# EAGLE design dtmf_rx (EAGLE 7.3.0)
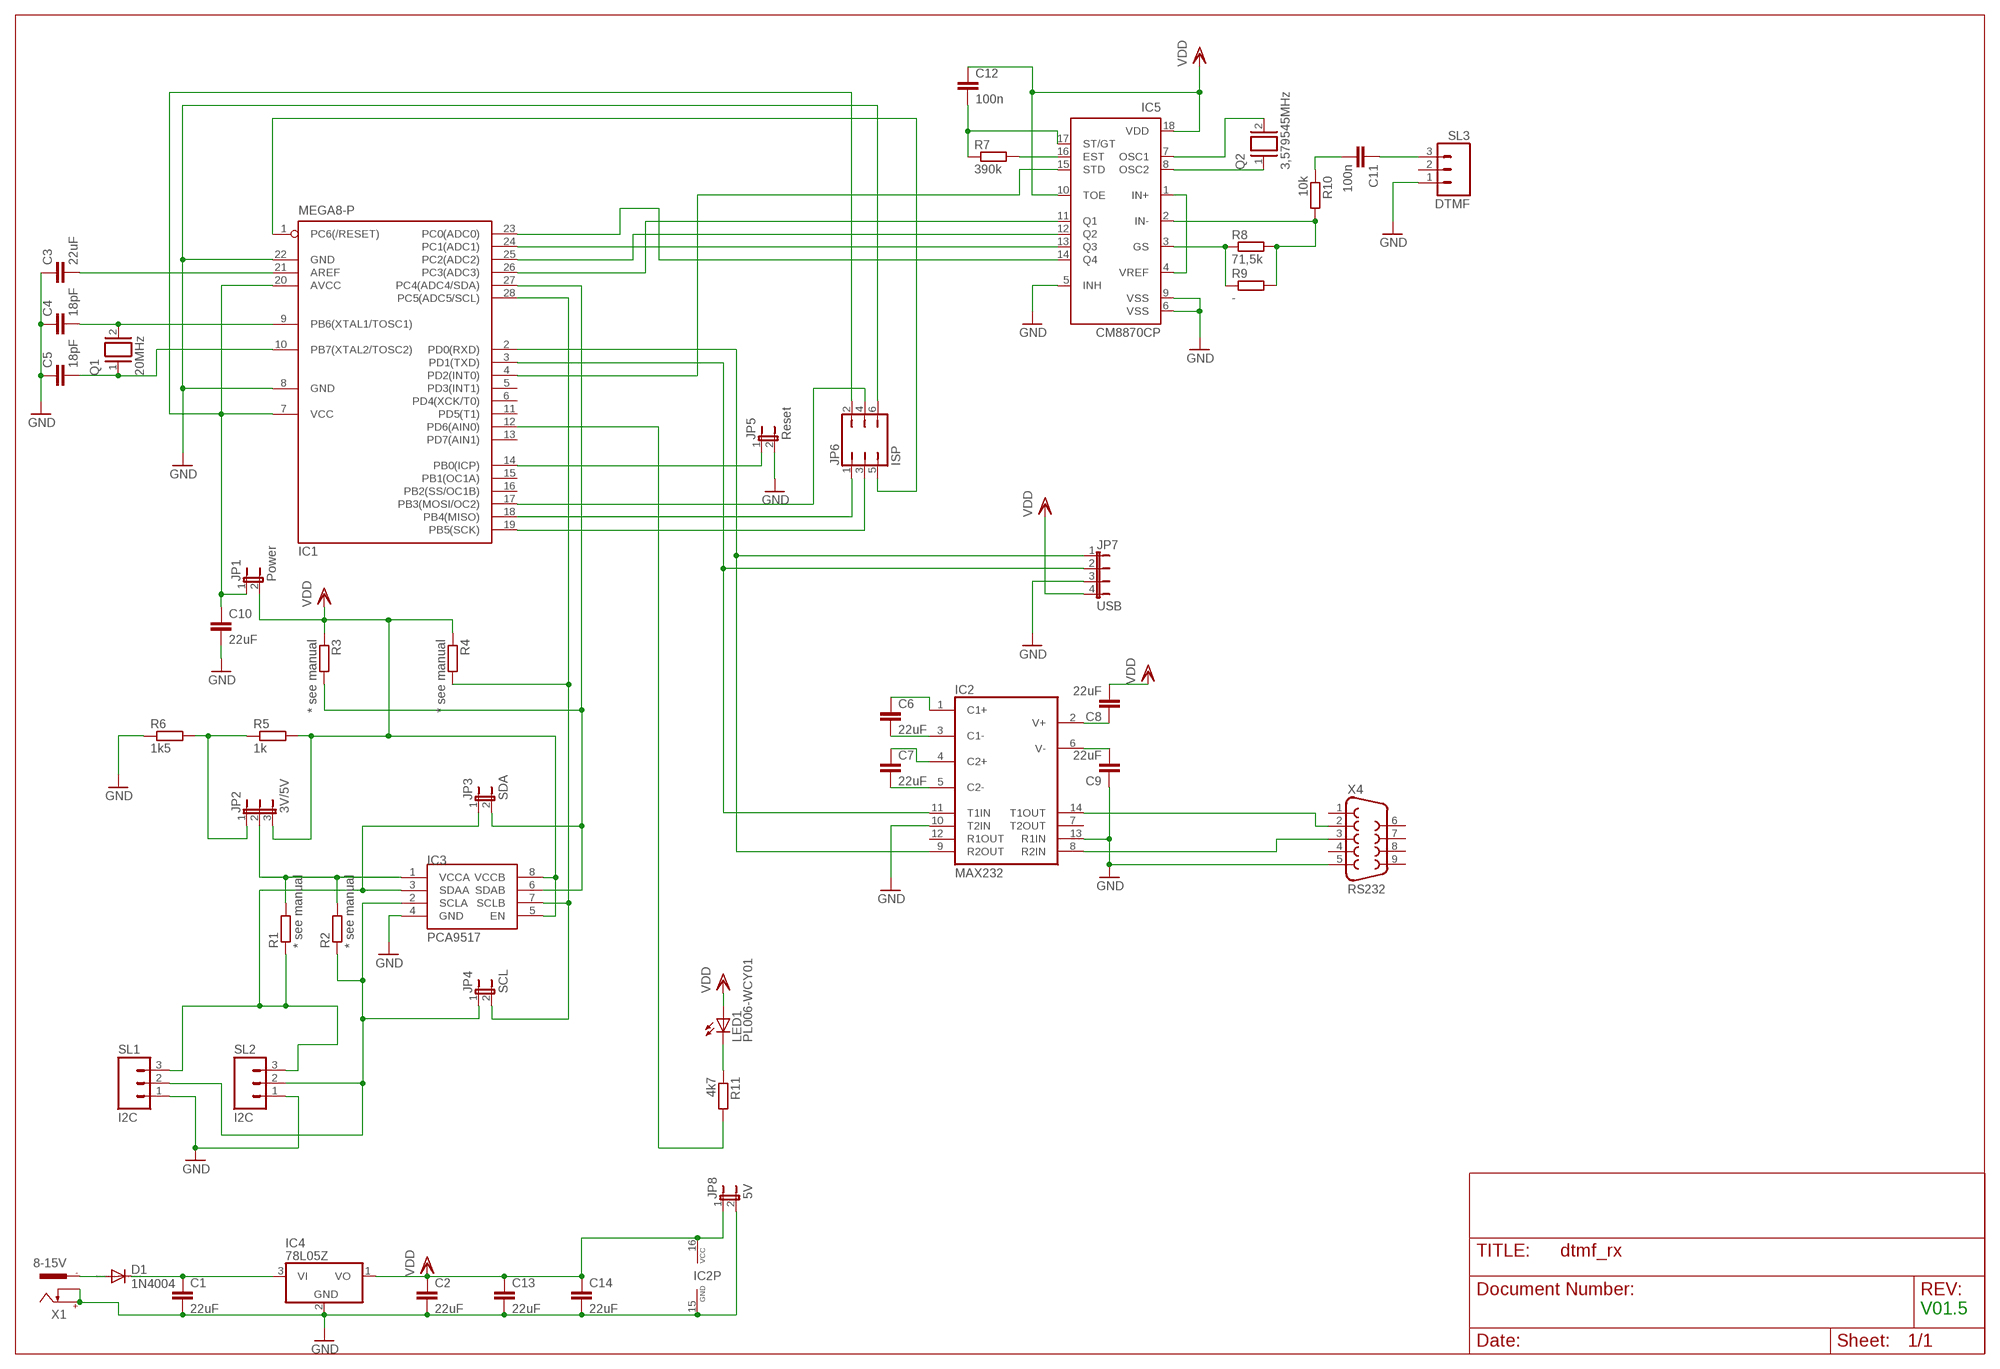
[diagram p0: schematic, sheet 1]

## Parts
C1  22uF  C-EUC1206  [C1206]
C2  22uF  C-EUC1206  [C1206]
C3  22uF  C-EUC1206  [C1206]
C4  18pF  C-EU025-025X050  [C025-025X050]
C5  18pF  C-EU025-025X050  [C025-025X050]
C6  22uF  C-EUC1206  [C1206]
C7  22uF  C-EUC1206  [C1206]
C8  22uF  C-EUC1206  [C1206]
C9  22uF  C-EUC1206  [C1206]
C10  22uF  C-EUC1206  [C1206]
C11  100n  C-EU050-025X075  [C050-025X075]
C12  100n  C-EU050-025X075  [C050-025X075]
C13  22uF  C-EUC1206  [C1206]
C14  22uF  C-EUC1206  [C1206]
D1  1N4004  [DO41-10]
IC1  MEGA8-P  [DIL28-3]
IC2  MAX232  [DIL16]
IC3  PCA9517  [SO-08]
IC4  78L05Z  [TO92]
IC5  CM8870CP  [DIL18]
JP1  Power  JP1E  [JP1]
JP2  3V/5V  JP2E  [JP2]
JP3  SDA  JP1E  [JP1]
JP4  SCL  JP1E  [JP1]
JP5  Reset  JP1E  [JP1]
JP6  ISP  JP3Q  [JP3Q]
JP7  USB  JP4E  [JP4]
JP8  5V  JP1E  [JP1]
LED1  PL006-WCY01  [SOT23]
Q1  20MHz  XTAL/S  [QS]
Q2  3,579545MHz  XTAL/S  [QS]
R1  * see manual  R-EU_R1206  [R1206]
R2  * see manual  R-EU_R1206  [R1206]
R3  * see manual  R-EU_R1206  [R1206]
R4  * see manual  R-EU_R1206  [R1206]
R5  1k  R-EU_R1206  [R1206]
R6  1k5  R-EU_R1206  [R1206]
R7  390k  R-EU_R1206  [R1206]
R8  71,5k  R-EU_R1206  [R1206]
R9  -  R-EU_R1206  [R1206]
R10  10k  R-EU_R1206  [R1206]
R11  4k7  R-EU_R1206  [R1206]
SL1  I2C  M03  [03P]
SL2  I2C  M03  [03P]
SL3  DTMF  M03  [03P]
X1  8-15V  737992-55  [737992-5]
X4  RS232  F09H  [F09H]

## Nets
C13: C6.1 IC2.1(C1+)
GND: C1.2 C2.2 C3.1 C4.1 C5.1 C9.1 C10.2 C13.2 C14.2 IC1.8(GND) IC1.22(GND) IC2.10(T2IN) IC2.13(R1IN) IC2.15(GND) IC3.4(GND) IC4.2(GND) IC5.5(INH) IC5.6(VSS) IC5.9(VSS) JP5.2 JP6.6 JP7.3 JP8.2 R6.1 SL1.1 SL2.1 SL3.1 X1.+ X1.K X4.5
N$1: IC1.12(PD6(AIN0)) R11.2
N$2: IC1.2(PD0(RXD)) IC2.9(R2OUT) JP7.1
N$3: C7.2 IC2.5(C2-)
N$4: IC2.14(T1OUT) X4.2
N$5: IC3.3(SDAA) JP3.1 R1.1 SL1.3 SL2.3
N$6: IC1.14(PB0(ICP)) JP5.1
N$7: IC5.1(IN+) IC5.4(VREF)
N$8: IC1.23(PC0(ADC0)) IC5.14(Q4)
N$10: JP2.1 R5.1 R6.2
N$11: IC2.8(R2IN) X4.3
N$12: IC1.3(PD1(TXD)) IC2.11(T1IN) JP7.2
N$13: C7.1 IC2.4(C2+)
N$14: C6.2 IC2.3(C1-)
N$15: IC1.18(PB4(MISO)) JP6.1
N$16: C8.1 IC2.2(V+)
N$17: C9.2 IC2.6(V-)
N$18: IC1.1(PC6(/RESET)) JP6.5
N$19: C4.2 IC1.9(PB6(XTAL1/TOSC1)) Q1.2
N$20: IC1.19(PB5(SCK)) JP6.3
N$21: C11.1 SL3.3
N$23: IC1.28(PC5(ADC5/SCL)) IC3.7(SCLB) JP4.2 R4.2
N$24: C11.2 R10.1
N$25: IC5.2(IN-) R8.2 R9.2 R10.2
N$26: IC5.3(GS) R8.1 R9.1
N$27: D1.A X1.-1
N$28: IC1.17(PB3(MOSI/OC2)) JP6.4
N$29: IC5.8(OSC2) Q2.1
N$30: IC1.24(PC1(ADC1)) IC5.13(Q3)
N$31: IC5.7(OSC1) Q2.2
N$32: IC5.16(EST) R7.2
N$33: C1.1 D1.C IC4.3(VI)
N$34: IC1.26(PC3(ADC3)) IC5.11(Q1)
N$35: C3.2 IC1.21(AREF)
N$36: IC1.27(PC4(ADC4/SDA)) IC3.6(SDAB) JP3.2 R3.2
N$37: C5.2 IC1.10(PB7(XTAL2/TOSC2)) Q1.1
N$38: IC1.25(PC2(ADC2)) IC5.12(Q2)
N$39: IC3.2(SCLA) JP4.1 R2.1 SL1.2 SL2.2
N$40: C12.2 IC5.17(ST/GT) R7.1
N$42: IC1.4(PD2(INT0)) IC5.15(STD)
N$43: IC3.1(VCCA) JP2.2 R1.2 R2.2
N$44: C10.1 IC1.7(VCC) IC1.20(AVCC) JP1.1 JP6.2
N$50: LED1.3(C) R11.1
VDD: C2.1 C8.2 C12.1 C13.1 C14.1 IC2.16(VCC) IC3.5(EN) IC3.8(VCCB) IC4.1(VO) IC5.10(TOE) IC5.18(VDD) JP1.2 JP2.3 JP7.4 JP8.1 LED1.1(A) R3.1 R4.1 R5.2
Unconnected: IC1.5(PD3(INT1)) IC1.6(PD4(XCK/T0)) IC1.11(PD5(T1)) IC1.13(PD7(AIN1)) IC1.15(PB1(OC1A)) IC1.16(PB2(SS/OC1B)) IC2.7(T2OUT) IC2.12(R1OUT) SL3.2 X1.-2 X4.1 X4.4 X4.6 X4.7 X4.8 X4.9

## Notes on the sheet
- V01.5

## Library data of the parts
C1-C3 C6-C14 = rcl:C-EU: CAPACITOR, European symbol
C4 C5 = resistor:C-EU: CAPACITOR, European symbol
D1 = diode:1N4004: DIODE general purpose rectifier, 1 A
IC1 = atmel:MEGA8-P: MICROCONTROLLER 8 Kbytes FLASH, 1 kbytes SRAM, 512 bytes EEPROM, USART, 4-channel 10 bit ADC, 2-channel 8 bit ADC Pin compatible with Atmega48, ATMega88, ATMega168 Source: avr.lbr; OC_FARNELL: unknown; OC_NEWARK: unknown
IC2 = maxim:MAX232: RS232 TRANSCEIVER; MF: MAXIM; MPN: MAX232ACPE+; OC_FARNELL: 9723773; OC_NEWARK: 68K4544
IC3 = PCA9517:PCA9517: PCA9517
IC4 = linear:78*: Positive VOLTAGE REGULATOR Source: http://cache.national.com/ds/LM/LM78L05.pdf http://www.fairchildsemi.com/ds/LM/LM7805.pdf
IC5 = california-micro-devices:CM8870C: CMOS Integrated DTMF Receiver cm8870.pdf; OC_FARNELL: unknown; OC_NEWARK: unknown
JP1 JP3-JP5 JP8 = jumper:JP1E: JUMPER
JP2 = jumper:JP2E: JUMPER
JP6 = jumper:JP3Q: JUMPER
JP7 = jumper:JP4E: JUMPER
LED1 = led:PL006*: PLH006 Series SMD LED SOT23 PLH006-WCR21 Super Red PLH006-WCR12 High Eff Red PLH006-WCG13 Green PLH006-WCY01 Yellow www.p-tec.net Source: http://www.wittig-electronic.de/PTEC/PL006Series.pdf
Q1 Q2 = special:XTAL/S: CRYSTAL
R1-R11 = resistor:R-EU_: RESISTOR, European symbol
SL1-SL3 = con-amp-quick:M03: AMP QUICK CONNECTOR; OC_FARNELL: unknown; OC_NEWARK: unknown
X1 = con-conrad:737992-55: FEMALE PRINT CONNECTOR DIN 45323 (34V/3A), ROKA, distributor Conrad
X4 = con-subd:F09: SUB-D; OC_FARNELL: unknown; OC_NEWARK: unknown

## Board
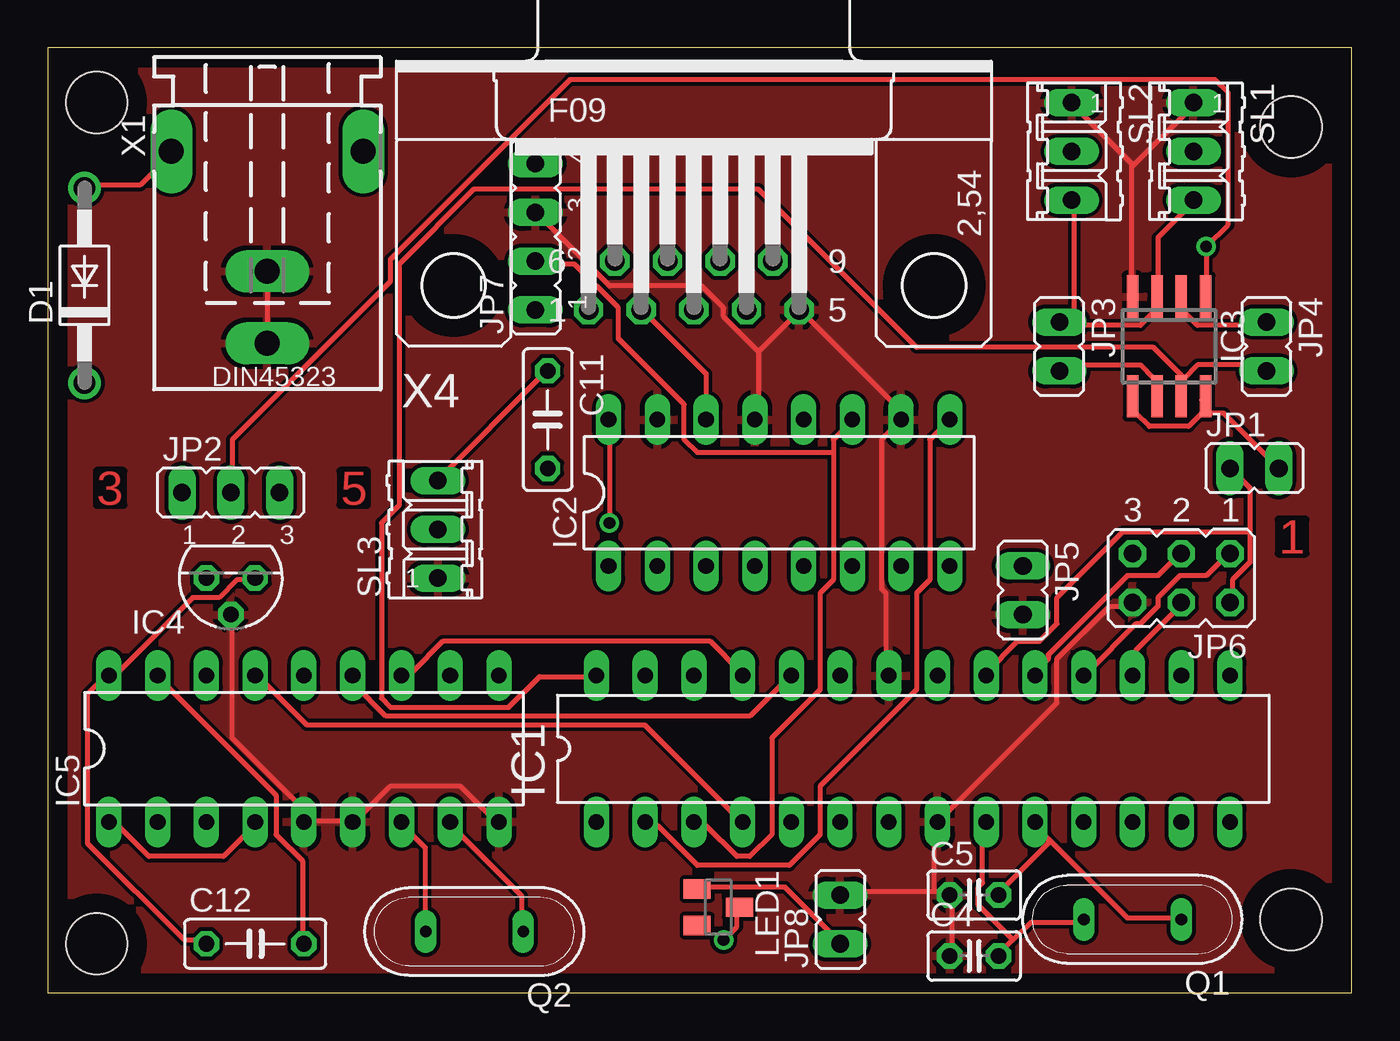
[diagram p1: board, top side]
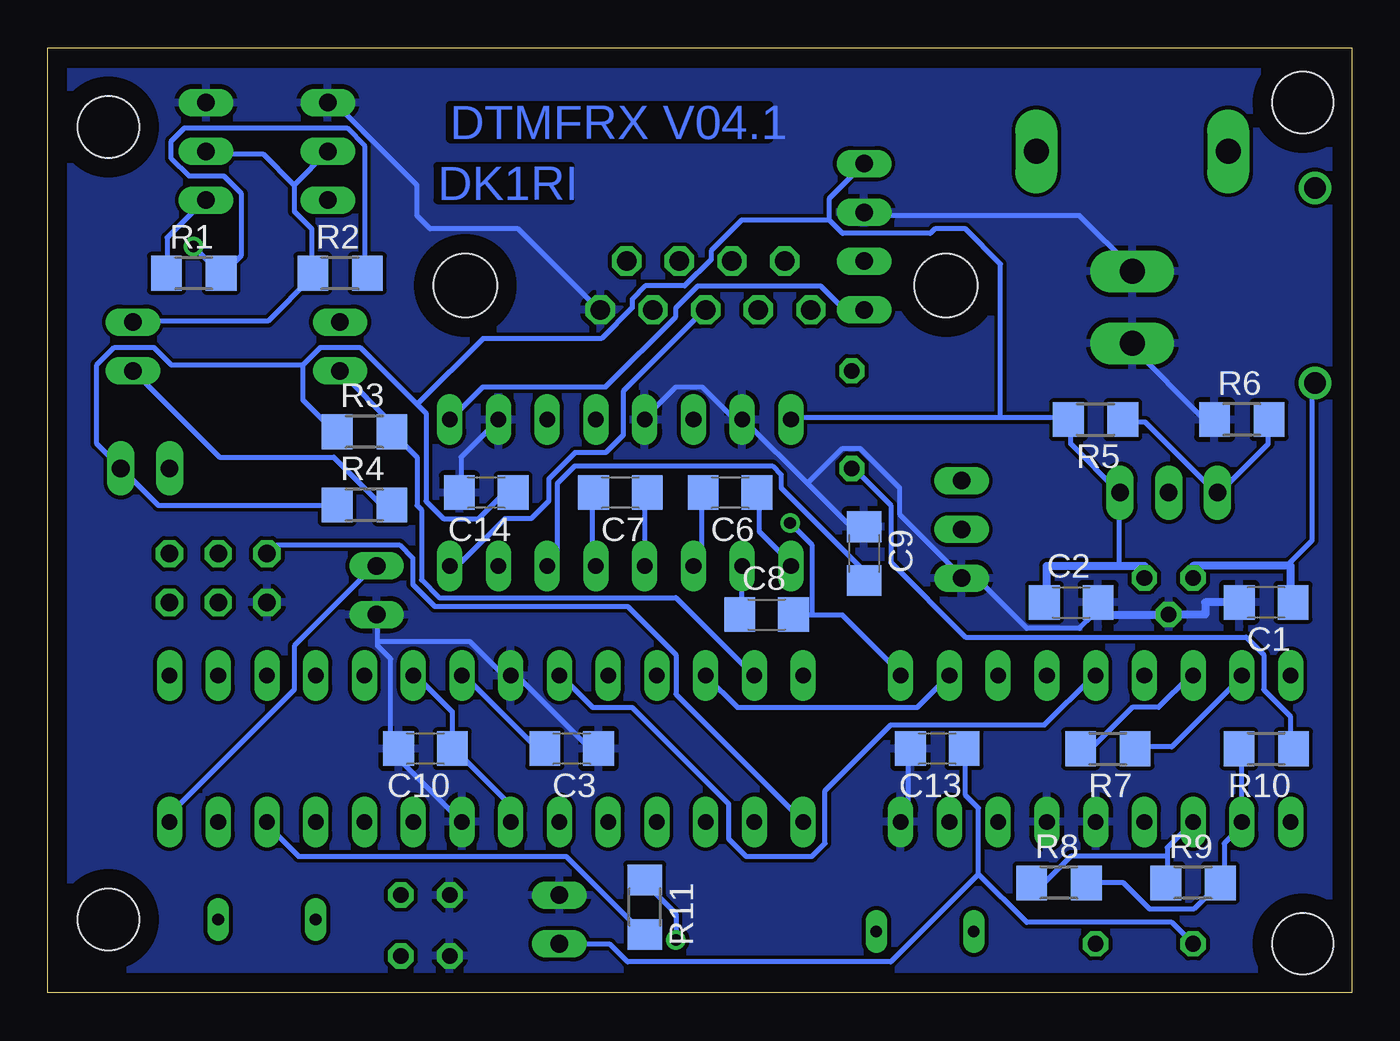
[diagram p2: board, bottom side, seen from below]

Size 67.92 x 49.2 mm. Coordinates in mm from the lower left corner, seen from the top.
Outline: 0,0 67.92,0 67.92,49.2 0,49.2 0,0
Copper layers (1*16): Top 0.035mm / dielectric 1.5mm / Bottom 0.035mm
Design rules "default": minimum track width 10mil, minimum drill 24mil, track to track 8mil, track to pad 8mil, pad to pad 8mil, via to via 8mil, smd to smd 8mil, copper to edge 40mil, drill to drill 8mil, minimum pad ring 10mil, minimum via ring 8mil, stop-mask expansion 4mil, vias tented up to drill 0mil, thermal gap 10mil
Holes 3.2 mm at 2.54,46.35 64.77,45.09 64.77,3.81 2.54,2.54

### Footprints (pad centres in the part's own frame; a part is rotated, then mirrored left to right if it is on the bottom)
C1206 = smd 1.6 x 1.8: 1 -1.4,0; 2 1.4,0
C025-025X050 = drill 0.813 octagon: 1 -1.27,0; 2 1.27,0
C050-025X075 = drill 0.813 octagon: 1 -2.54,0; 2 2.54,0
DO41-10 = drill 1.118: A 5.08,0; C -5.08,0
DIL28-3 = drill 0.813 long: 1 -16.51,-3.81; 2 -13.97,-3.81; 3 -11.43,-3.81; 4 -8.89,-3.81; 5 -6.35,-3.81; 6 -3.81,-3.81; 7 -1.27,-3.81; 8 1.27,-3.81; 9 3.81,-3.81; 10 6.35,-3.81; 11 8.89,-3.81; 12 11.43,-3.81; 13 13.97,-3.81; 14 16.51,-3.81; 15 16.51,3.81; 16 13.97,3.81; 17 11.43,3.81; 18 8.89,3.81; 19 6.35,3.81; 20 3.81,3.81; 21 1.27,3.81; 22 -1.27,3.81; 23 -3.81,3.81; 24 -6.35,3.81; 25 -8.89,3.81; 26 -11.43,3.81; 27 -13.97,3.81; 28 -16.51,3.81
DIL16 = drill 0.813 long: 1 -8.89,-3.81; 2 -6.35,-3.81; 3 -3.81,-3.81; 4 -1.27,-3.81; 5 1.27,-3.81; 6 3.81,-3.81; 7 6.35,-3.81; 8 8.89,-3.81; 9 8.89,3.81; 10 6.35,3.81; 11 3.81,3.81; 12 1.27,3.81; 13 -1.27,3.81; 14 -3.81,3.81; 15 -6.35,3.81; 16 -8.89,3.81
SO-08 = smd 0.6 x 2.2: 1 -1.905,-2.6; 2 -0.635,-2.6; 3 0.635,-2.6; 4 1.905,-2.6; 5 1.905,2.6; 6 0.635,2.6; 7 -0.635,2.6; 8 -1.905,2.6
TO92 = drill 0.813 octagon: 1 -1.27,0; 2 0,1.905; 3 1.27,0
DIL18 = drill 0.813 long: 1 -10.16,-3.81; 2 -7.62,-3.81; 3 -5.08,-3.81; 4 -2.54,-3.81; 5 0,-3.81; 6 2.54,-3.81; 7 5.08,-3.81; 8 7.62,-3.81; 9 10.16,-3.81; 10 10.16,3.81; 11 7.62,3.81; 12 5.08,3.81; 13 2.54,3.81; 14 0,3.81; 15 -2.54,3.81; 16 -5.08,3.81; 17 -7.62,3.81; 18 -10.16,3.81
JP1 = drill 0.914 long: 1 0,-1.27; 2 0,1.27
JP2 = drill 0.914 long: 1 -2.54,0; 2 0,0; 3 2.54,0
JP3Q = drill 0.914 octagon: 1 -2.54,-1.27; 2 -2.54,1.27; 3 0,-1.27; 4 0,1.27; 5 2.54,-1.27; 6 2.54,1.27
JP4 = drill 0.914 long: 1 -3.81,0; 2 -1.27,0; 3 1.27,0; 4 3.81,0
SOT23 = smd 1 x 1.4: 1 -0.95,-1.1; 2 0.95,-1.1; 3 0,1.1
QS = drill 0.61 long: 1 -2.54,0; 2 2.54,0
R1206 = smd 1.6 x 1.803: 1 -1.422,0; 2 1.422,0
03P = drill 0.914 long: 1 -2.54,0; 2 0,0; 3 2.54,0
737992-5 = drill 1.3 pad 2.184 long: + 0,10; -1 5,0; -2 -5,0; K 0,6.25
F09H = drill 1.016 octagon: 1 -5.486,-1.27; 2 -2.743,-1.27; 3 0,-1.27; 4 2.743,-1.27; 5 5.486,-1.27; 6 -4.115,1.27; 7 -1.372,1.27; 8 1.372,1.27; 9 4.115,1.27 | hole 3.302: -12.522,0; 12.522,0

### Placement (x,y rotation side)
C1  4.45,20.32 180 bottom
C2  14.61,20.32 0 bottom
C3  40.64,12.7 180 bottom
C4  48.26,1.91 0 top
C5  48.26,5.08 0 top
C6  32.38,26.04 180 bottom
C7  38.1,26.04 180 bottom
C8  30.48,19.68 0 bottom
C9  25.4,22.86 270 bottom
C10  48.26,12.7 180 bottom
C11  26.04,29.84 270 top
C12  10.79,2.54 0 top
C13  21.59,12.7 180 bottom
C14  45.09,26.04 180 bottom
D1  1.91,36.83 90 top
IC1  45.09,12.7 0 top
IC2  38.1,26.04 0 top
IC3  58.42,33.66 180 top
IC4  9.53,21.59 180 top
IC5  13.34,12.7 0 top
JP1  62.87,27.3 270 top
JP2  9.53,26.04 0 top
JP3  52.7,33.66 180 top
JP4  63.5,33.66 180 top
JP5  50.8,20.95 180 top
JP6  59.05,21.59 180 top
JP7  25.4,39.37 90 top
JP8  41.27,3.81 0 top
LED1  34.92,4.45 270 top
Q1  56.52,3.81 180 top
Q2  22.23,3.17 180 top
R1  60.33,37.47 0 bottom
R2  52.7,37.47 0 bottom
R3  51.44,29.21 0 bottom
R4  51.44,25.4 0 bottom
R5  13.34,29.84 180 bottom
R6  5.71,29.84 0 bottom
R7  12.7,12.7 180 bottom
R8  15.24,5.71 0 bottom
R9  8.26,5.71 0 bottom
R10  4.45,12.7 180 bottom
R11  36.83,4.45 270 bottom
SL1  59.69,43.81 270 top
SL2  53.34,43.81 270 top
SL3  20.32,24.13 90 top
X1  11.43,43.81 180 top
X4  33.66,36.83 0 top

### Tracks (layer width: path | path; a pad name or v marks a point on that pad's centre or on a via)
C13
  Bottom 0.254: C6.1 30.86,25.83 30.86,24 29.26,22.4 IC2.1
GND
  Top 0.254: C4.1 47.09,2.06 47.09,5.03 C5.1 46.86,5.26 46.18,5.26 | 46.18,5.26 41.38,5.26 JP8.2 | JP6.6 56.46,20.12 55.32,20.12 52.58,17.37 52.58,15.09 46.41,8.91 IC1.8 46.18,8.69 46.18,5.26 | X1.K X1.+ | IC5.9 23.32,8.91 21.49,10.74 17.83,10.74 16,8.91 IC5.6 15.77,8.91 13.49,8.91 IC5.5 13.26,8.91 13.26,9.6 9.6,13.26 9.6,19.66 IC4.2 | 56.46,42.98 56.46,43.2 53.49,46.18 SL2.1 | 56.46,42.98 56.46,36.35 IC3.4 | 56.46,42.98 59.66,46.18 SL1.1 | 37.03,33.38 37.03,29.95 IC2.13 | 37.03,33.38 39.09,35.43 X4.5 39.32,35.43 44.35,30.4 44.35,29.95 IC2.10 44.35,29.72 43.43,28.8 43.43,21.03 43.66,20.8 43.66,16.69 IC1.22 | 37.03,33.38 35.2,35.2 35.2,35.66 34.06,36.8 29.26,36.8 25.6,40.46 JP7.3
  Bottom 0.254: C3.1 39.32,12.8 39.78,12.8 43.66,16.69 IC1.22 43.89,16.69 44.35,16.69 45.95,18.29 50.75,18.29 | IC1.8 46.41,8.91 49.61,12.12 49.61,12.57 C10.2 49.84,12.8 50.06,13.03 50.06,17.37 50.75,18.06 50.75,18.29 | 50.75,18.29 50.75,19.66 JP5.2 | R6.1 7.32,29.95 7.77,29.95 11.43,33.6 X1.+ | JP7.3 25.38,40.46 14.17,40.46 11.43,37.72 X1.K | C13.2 23.09,12.57 23.09,9.14 23.32,8.91 IC5.9 | IC2.10 46.41,27.89 46.41,26.06 C14.2 | IC2.13 36.8,29.95 35.2,31.55 33.83,31.55 32.23,29.95 31.77,29.95 IC2.15 31.55,29.72 28.35,26.52 | SL2.1 53.26,46.18 52.81,46.18 48.69,42.06 48.69,40.46 48.01,39.78 43.43,39.78 39.32,35.66 X4.5 | C2.2 13.49,19.66 14.17,18.97 16.92,18.97 19.43,21.49 20.12,21.49 SL3.1 20.34,21.72 23.55,24.92 23.55,26.29 25.6,28.35 26.52,28.35 28.35,26.52 | 28.35,26.52 26.29,24.46 25.6,24.46 C9.1
  Bottom 0.406: C1.2 7.62,20.32 7.62,19.68 IC4.2 13.34,19.68 13.34,20.32 C2.2
  pour Top: 0.64,48.26 67.31,48.26 67.31,0.64 0.64,0.64
  pour Bottom: 0.64,48.26 67.31,48.26 67.31,0.64 0.64,0.64
N$1
  Bottom 0.254: R11.2 37.03,3.2 40.92,7.09 54.86,7.09 56.46,8.69 IC1.12
N$2
  Top 0.254: IC2.9 45.95,28.8 45.95,21.49 45.26,20.8 45.26,15.77 40.23,10.74 40.23,8.23 38.63,6.63 33.83,6.63 31.77,8.69 31.32,8.69 IC1.2
  Bottom 0.254: JP7.1 25.6,35.66 26.52,35.66 27.66,36.8 34.06,36.8 35.2,35.66 35.2,35.2 38.86,31.55 45.26,31.55 46.86,29.95 IC2.9
N$3
  Bottom 0.254: C7.2 39.55,25.83 39.55,22.4 IC2.5
N$4
  Top 0.254: IC2.14 34.29,32.23 31.09,35.43 X4.2
N$5
  Top 0.254: SL1.3 59.66,41.15 57.84,39.32 57.84,36.35 IC3.3 57.61,36.12 57.61,35.43 56.92,34.75 53.49,34.75 | 53.49,34.75 52.81,34.75 JP3.1 53.49,34.75 | 53.49,34.75 53.49,41.15 SL2.3
  Bottom 0.254: R1.1 61.72,37.49 61.72,39.32 59.89,41.15 SL1.3
N$6
  Bottom 0.254: IC1.14 61.49,8.91 61.49,9.37 55.09,15.77 55.09,18.06 50.98,22.17 JP5.1
N$7
  Top 0.254: IC5.1 3.2,8.69 3.66,8.69 5.26,7.09 9.14,7.09 10.74,8.69 IC5.4
N$8
  Bottom 0.254: IC5.14 13.49,16.46 16,13.95 24,13.95 27.43,10.52 27.43,7.77 28.12,7.09 31.55,7.09 32.46,8 32.46,9.83 37.49,14.86 39.55,14.86 41.15,16.46 IC1.23
N$10
  Bottom 0.254: R6.2 4.34,29.72 4.34,28.57 6.86,26.06 JP2.1 7.09,26.06 10.74,29.72 11.89,29.72 R5.1
N$11
  Bottom 0.254: IC2.8 46.86,22.4 46.41,22.4 44.12,24.69 42.75,24.69 41.83,25.6 41.83,26.75 40.46,28.12 38.86,28.12 37.95,29.03 37.95,31.32 33.83,35.43 X4.3
N$12
  Top 0.254: 40.92,28.12 40.92,28.8 41.83,29.72 IC2.11 | 40.92,28.12 40.92,21.49 40.23,20.8 40.23,15.77 37.72,13.26 37.72,8.23 36.58,7.09 35.89,7.09 34.29,8.69 33.83,8.69 IC1.3 | 40.92,28.12 33.83,28.12 33.15,28.8 33.15,30.63 29.72,34.06 29.72,35.66 27.43,37.95 25.6,37.95 JP7.2
N$13
  Bottom 0.254: C7.1 36.8,25.83 36.8,22.4 IC2.4
N$14
  Bottom 0.254: C6.2 33.83,25.83 33.83,22.86 34.29,22.4 IC2.3
N$15
  Top 0.254: IC1.18 54.18,16.69 56.69,19.2 56.92,19.2 57.84,20.12 57.84,20.57 58.98,21.72 60.35,21.72 61.49,22.86 JP6.1
N$16
  Bottom 0.254: C8.1 31.77,19.89 31.77,22.17 IC2.2
N$17
  Bottom 0.254: C9.2 25.6,21.49 25.6,22.17 29.72,26.29 29.72,26.98 30.18,27.43 40.46,27.43 41.38,26.52 41.38,22.86 41.83,22.4 IC2.6
N$18
  Bottom 0.254: IC1.1 28.57,8.91 35.2,15.54 35.2,17.6 37.72,20.12 47.78,20.12 48.92,21.26 48.92,22.63 49.61,23.32 56.01,23.32 56.46,22.86 JP6.5
N$19
  Top 0.254: 50.29,2.74 49.61,2.06 C4.2 | 50.29,2.74 51.21,3.66 53.95,3.66 Q1.2 | 50.29,2.74 48.46,4.57 48.46,5.49 48.69,5.71 48.69,8.69 IC1.9
N$20
  Top 0.254: IC1.19 51.44,16.69 52.12,17.37 52.12,17.6 56.24,21.72 57.84,21.72 58.98,22.86 JP6.3
N$21
  Top 0.254: C11.1 25.83,32.23 20.34,26.75 SL3.3
N$23
  Top 0.254: 59.21,32 59.21,31.09 IC3.7 59.21,32 | 59.21,32 59.89,32.69 63.09,32.69 63.32,32.46 JP4.2 | 59.21,32 57.61,33.6 45.26,33.6 37.03,41.83 22.17,41.83 18.29,37.95 18.29,25.38 17.37,24.46 17.37,15.32 17.83,14.86 24,14.86 25.6,16.46 28.57,16.46 IC1.28
  Bottom 0.254: R4.2 50.06,25.6 50.75,25.6 53.03,27.89 58.98,27.89 63.32,32.23 JP4.2
N$24
  Bottom 0.254: R10.1 3.2,12.8 3.2,14.4 4.57,15.77 4.57,17.6 5.49,18.52 20.12,18.52 24,22.4 24,25.38 25.83,27.2 C11.2
N$25
  Bottom 0.254: R8.2 11.89,5.71 10.52,4.34 8.23,4.34 6.86,5.71 R9.2 6.63,5.71 6.63,7.77 5.71,8.69 IC5.2 5.71,12.57 R10.2
N$26
  Bottom 0.254: 9.6,7.09 9.6,7.54 IC5.3 | 9.6,7.09 9.6,5.71 R9.1 | R8.1 16,5.71 14.63,7.09 9.6,7.09
N$27
  Top 0.254: D1.A 2.06,42.06 4.8,42.06 6.4,43.66 X1.-1
N$28
  Top 0.254: IC1.17 56.69,16.69 56.69,17.83 58.98,20.12 JP6.4
N$29
  Top 0.254: Q2.1 24.69,3.2 24.69,5.03 21.03,8.69 IC5.8
N$30
  Top 0.254: IC5.13 16,16.46 16,16 17.6,14.4 36.58,14.4 38.63,16.46 IC1.24
N$31
  Top 0.254: Q2.2 19.66,3.2 19.66,7.54 18.52,8.69 IC5.7
N$32
  Bottom 0.254: R7.2 13.95,12.8 13.49,12.8 11.43,14.86 10.06,14.86 8.46,16.46 IC5.16
N$33
  Bottom 0.254: D1.C 2.06,31.55 2.06,23.55 3.2,22.4 3.2,22.23
  Bottom 0.406: C1.1 3.17,20.32 3.17,22.23 3.2,22.23 8.26,22.23 IC4.3
N$34
  Bottom 0.254: IC1.26 32,14.86 22.63,14.86 21.03,16.46 IC5.11
N$35
  Bottom 0.254: C3.2 42.06,12.8 42.52,12.8 46.18,16.46 IC1.21
N$36
  Top 0.254: IC3.6 57.61,31.09 57.61,32 56.92,32.69 53.03,32.69 52.81,32.46 JP3.2
  Bottom 0.254: JP3.2 52.58,32.23 50.06,29.72 50.06,29.26 R3.2 49.84,29.03 48.69,27.89 48.69,25.38 48.46,25.15 48.46,21.49 47.55,20.57 35.2,20.57 31.32,16.69 IC1.27
N$37
  Top 0.254: 52.12,8 51.44,8.69 IC1.10 | 52.12,8 56.24,3.89 58.98,3.89 Q1.1 | 52.12,8 52.12,7.77 49.61,5.26 C5.2
N$38
  Top 0.254: IC5.12 18.52,16.69 18.97,16.69 20.57,18.29 34.52,18.29 36.12,16.69 IC1.25
N$39
  Top 0.254: IC3.2 59.21,36.12 59.21,35.43 59.89,34.75 63.32,34.75 JP4.1
  Bottom 0.254: 55.09,42.06 55.09,40.69 54.18,39.78 54.18,37.49 R2.1 54.18,37.26 56.46,34.98 63.32,34.98 JP4.1 | SL2.2 55.09,42.06 | 55.09,42.06 56.69,43.66 59.66,43.66 SL1.2
N$40
  Top 0.254: C12.2 13.26,2.74 13.26,6.86 11.89,8.23 11.89,10.29 5.71,16.46 IC5.17
  Bottom 0.254: R7.1 11.2,12.8 9.37,12.8 5.71,16.46 IC5.17
N$42
  Top 0.254: IC1.4 36.12,8.91 31.09,13.95 13.49,13.95 10.97,16.46 IC5.15
N$43  (via drill 0.61)
  Top 0.254: IC3.1 60.35,36.35 v60.35,38.86 61.49,40.01 61.49,46.86 60.81,47.55 27.2,47.55 17.83,38.18 17.83,37.03 9.6,28.8 9.6,26.06 JP2.2
  Bottom 0.254: R2.2 51.44,37.49 51.44,44.12 52.35,45.03 60.81,45.03 61.49,44.35 61.49,43.43 60.58,42.52 58.75,42.52 57.84,41.6 57.84,38.41 58.75,37.49 R1.2 58.98,37.49 v60.35,38.86
N$44
  Top 0.254: 62.64,24 62.64,26.29 61.72,27.2 JP1.1 | 62.64,24 62.64,22.4 61.72,21.49 61.72,20.34 JP6.2 | 62.64,24 56.01,24 52.58,20.57 52.58,19.2 51.66,18.29 50.52,18.29 48.92,16.69 IC1.20
  Bottom 0.254: IC1.20 48.69,16.46 46.86,14.63 46.86,12.8 C10.1 46.63,12.57 43.89,9.83 43.89,8.91 IC1.7
N$50  (via drill 0.61)
  Top 0.254: v35.2,2.74 35.89,3.43 35.89,4.34 LED1.3
  Bottom 0.254: v35.2,2.74 35.2,4.12 36.8,5.71 R11.1
VDD  (via drill 0.61)
  Top 0.254: LED1.1 33.83,5.49 38.41,5.49 41.15,2.74 JP8.1 | 60.12,30.18 59.44,29.49 57.38,29.49 56.69,30.18 56.69,30.86 IC3.5 | 60.12,30.18 60.12,30.86 IC3.8 60.12,30.18 | 60.12,30.18 61.27,30.18 JP1.2 | IC4.1 10.74,21.49 9.83,21.49 8.91,20.57 7.54,20.57 3.66,16.69 3.2,16.69 IC5.18 2.97,16.46 2.06,15.54 2.06,7.77 7.09,2.74 8.23,2.74 C12.1 | v29.26,24.46 29.26,29.72 IC2.16
  Bottom 0.254: 19.43,6.17 19.43,9.6 20.12,10.29 20.12,12.57 C13.1 | 19.43,6.17 16.92,3.66 9.37,3.66 C12.1 | 19.43,6.17 24,1.6 37.72,1.6 38.63,2.52 41.15,2.52 JP8.1 | 48.69,30.63 51.66,33.6 53.72,33.6 54.63,32.69 | 48.69,30.63 48.23,30.18 48.23,25.6 47.32,24.69 45.49,24.69 44.35,25.83 43.89,25.83 C14.1 | 54.63,32.69 54.63,30.86 53.03,29.26 R3.1 | R4.1 53.03,25.38 62.18,25.38 64.01,27.2 JP1.2 64.24,27.43 65.38,28.57 65.38,32.69 64.47,33.6 62.41,33.6 61.49,32.69 54.63,32.69 | 28.12,19.66 26.52,19.66 23.55,16.69 IC5.10 | 28.12,19.66 29.03,19.66 C8.2 | 18.29,29.95 14.86,29.95 R5.2 14.63,29.72 14.63,28.57 12.12,26.06 JP2.3 12.12,25.83 12.12,22.23 | 18.29,29.95 29.03,29.95 IC2.16 | JP7.4 27.2,41.38 27.2,40.23 | 27.2,40.23 26.52,39.55 21.95,39.55 21.72,39.78 20.12,39.78 18.29,37.95 18.29,29.95 | 28.12,19.66 28.12,23.32 v29.26,24.46 | 48.69,30.63 45.26,34.06 39.09,34.06 37.49,35.66 37.49,36.12 36.8,36.8 34.75,36.8 33.38,38.18 33.38,38.63 31.77,40.23 27.2,40.23
  Bottom 0.406: C2.1 15.88,20.32 15.88,22.23 12.12,22.23 10.79,22.23 IC4.1

### Text on the board
Top: 3 | 5 | 1
Bottom: DTMFRX V04.1 | DK1RI